# Altium project 7953_VHDC_TO_IDC.PrjPcb
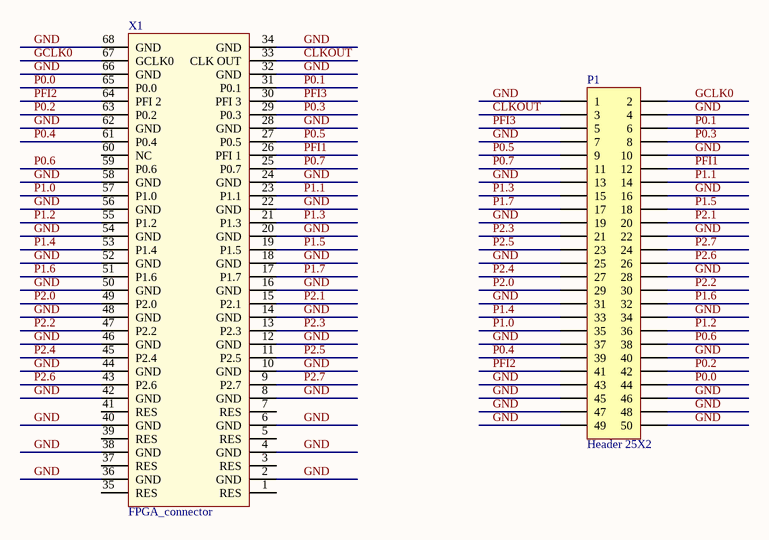
[diagram p0: 7953_VHDC.SchDoc]
1 sheet, 2 parts. Net scope: global (net labels, ports and power ports of the same name join across sheets).
Board file: 7953_VHDC.PcbDoc

## Sheet 7953_VHDC.SchDoc
size A3; SheetNumber: 1; SheetTotal: 1

### Parts
P1  Header 25X2  [HDR2X25]
X1  FPGA_connector  [FPGA]

### Nets
CLKOUT: P1.3 X1.33(CLK_OUT)
GCLK0: P1.2 X1.67(GCLK0)
GND: P1.1 P1.4 P1.7 P1.10 P1.13 P1.16 P1.19 P1.22 P1.25 P1.28 P1.31 P1.34 P1.37 P1.40 P1.43 P1.45 P1.46 P1.47 P1.48 P1.49 P1.50 X1.2(GND) X1.4(GND) X1.6(GND) X1.8(GND) X1.10(GND) X1.12(GND) X1.14(GND) X1.16(GND) X1.18(GND) X1.20(GND) X1.22(GND) X1.24(GND) X1.28(GND) X1.32(GND) X1.34(GND) X1.36(GND) X1.38(GND) X1.40(GND) X1.42(GND) X1.44(GND) X1.46(GND) X1.48(GND) X1.50(GND) X1.52(GND) X1.54(GND) X1.56(GND) X1.58(GND) X1.62(GND) X1.66(GND) X1.68(GND)
P0.0: P1.44 X1.65(P0.0)
P0.1: P1.6 X1.31(P0.1)
P0.2: P1.42 X1.63(P0.2)
P0.3: P1.8 X1.29(P0.3)
P0.4: P1.39 X1.61(P0.4)
P0.5: P1.9 X1.27(P0.5)
P0.6: P1.38 X1.59(P0.6)
P0.7: P1.11 X1.25(P0.7)
P1.0: P1.35 X1.57(P1.0)
P1.1: P1.14 X1.23(P1.1)
P1.2: P1.36 X1.55(P1.2)
P1.3: P1.15 X1.21(P1.3)
P1.4: P1.33 X1.53(P1.4)
P1.5: P1.18 X1.19(P1.5)
P1.6: P1.32 X1.51(P1.6)
P1.7: P1.17 X1.17(P1.7)
P2.0: P1.29 X1.49(P2.0)
P2.1: P1.20 X1.15(P2.1)
P2.2: P1.30 X1.47(P2.2)
P2.3: P1.21 X1.13(P2.3)
P2.4: P1.27 X1.45(P2.4)
P2.5: P1.23 X1.11(P2.5)
P2.6: P1.26 X1.43(P2.6)
P2.7: P1.24 X1.9(P2.7)
PFI1: P1.12 X1.26(PFI_1)
PFI2: P1.41 X1.64(PFI_2)
PFI3: P1.5 X1.30(PFI_3)

Not connected (* = marked no-connect by the designer): X1 1(RES) 3(RES) 5(RES) 7(RES) 35(RES) 37(RES) 39(RES) 41(RES) 60(NC)

### Library data of the parts
P1 = Header 25X2: Header, 25-Pin, Dual row; LatestRevisionDate: 17-Jul-2002; LatestRevisionNote: Re-released for DXP Platform.; Publisher: Altium Limited